# EAGLE schematic ILIZAROV_2 (EAGLE 7.2.0)
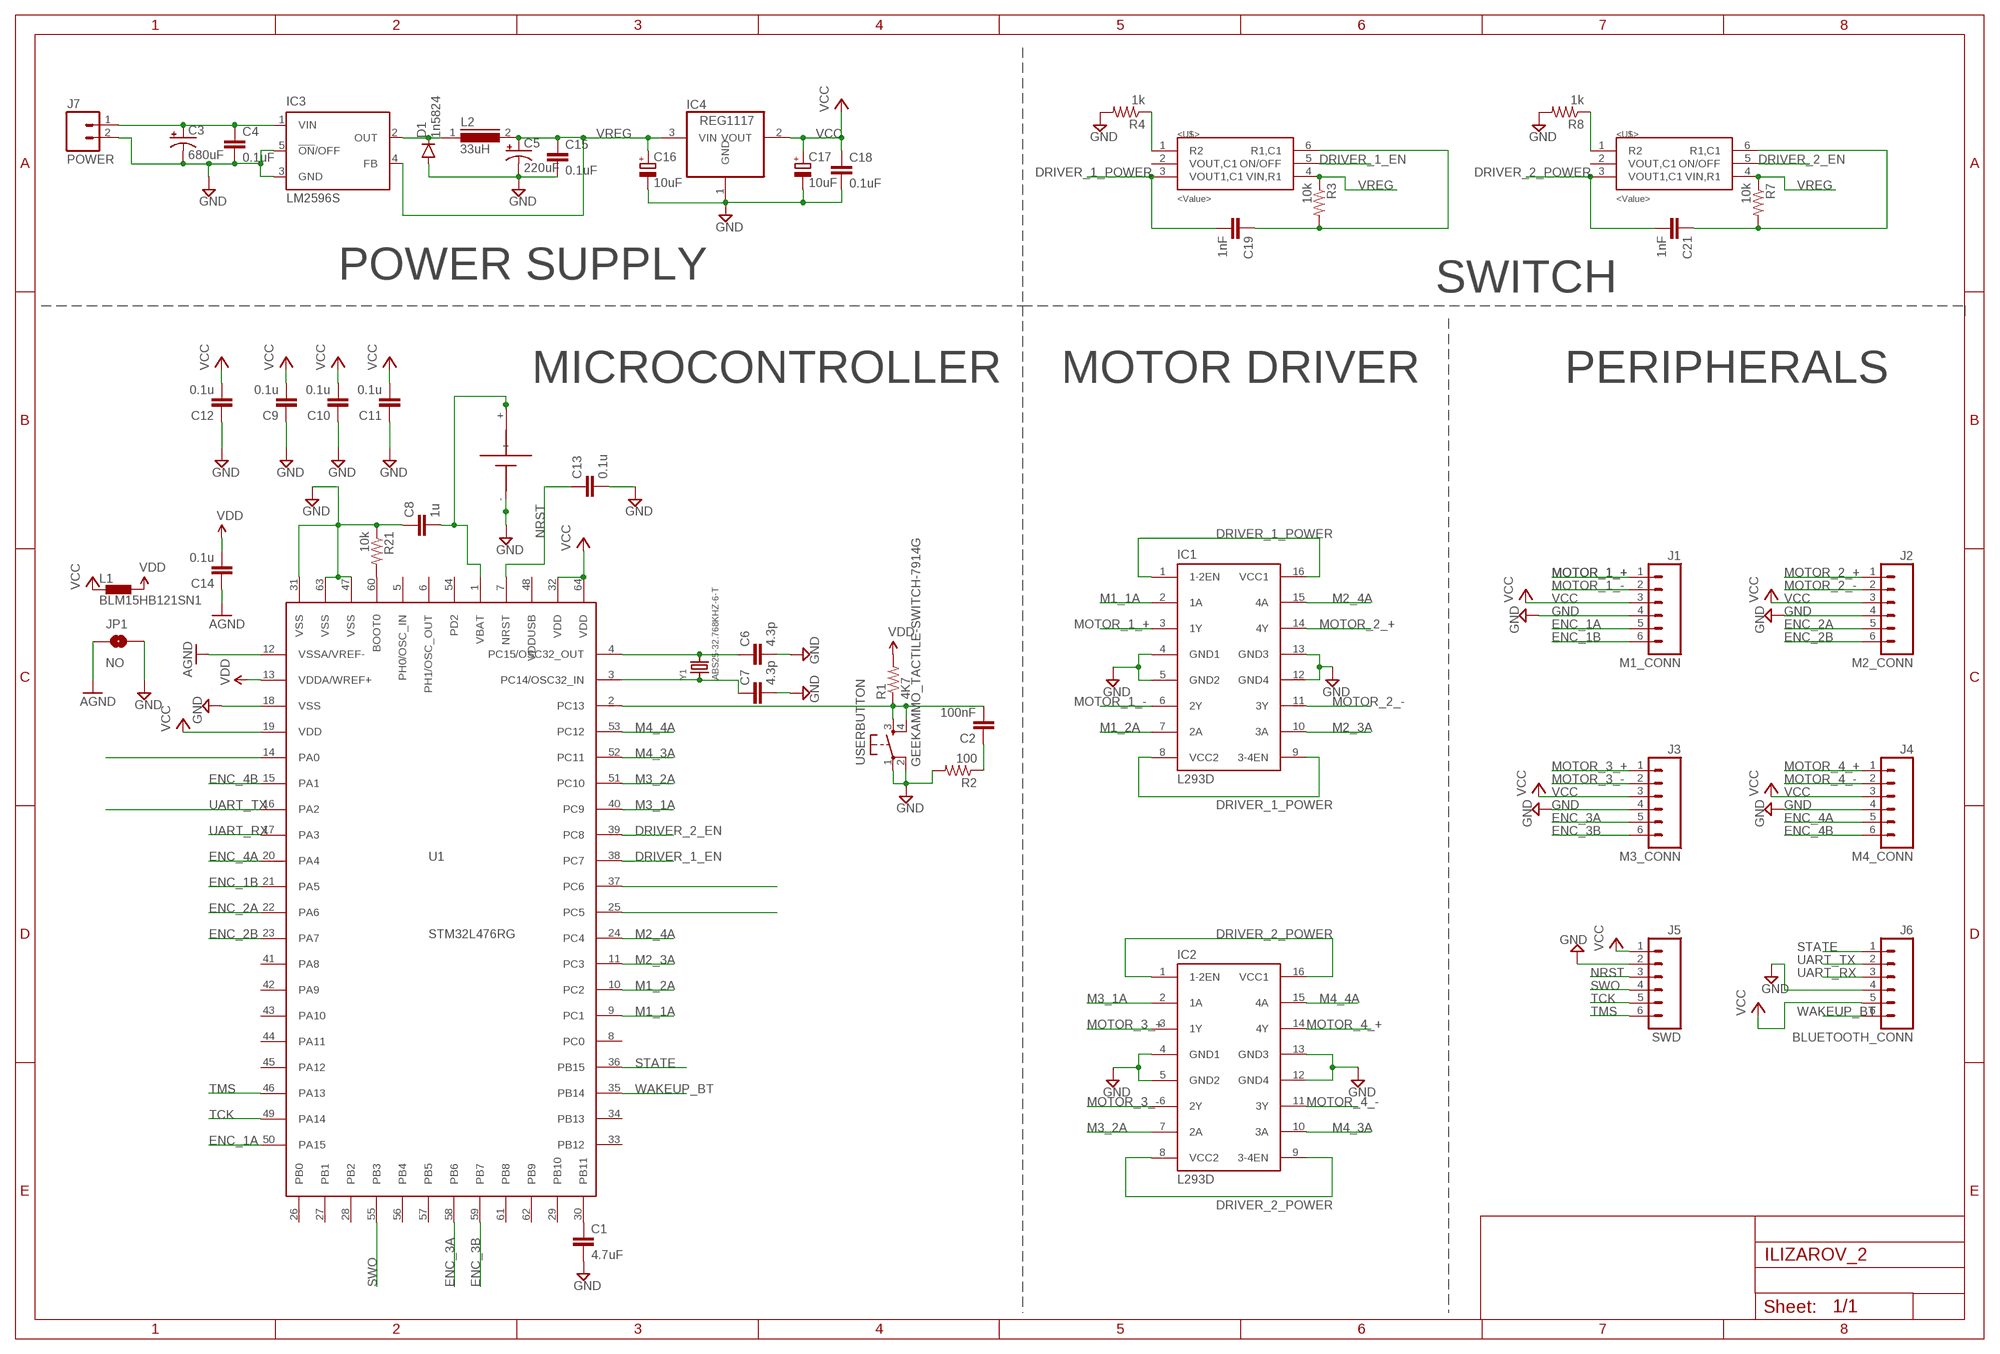
[diagram p0: schematic, sheet 1]

## Parts
BLUETOOTH_CONN  J6  M06  [06P]
C1  4.7uF  CAP1206  [1206]
C2  100nF  C-EUC0805  [C0805]
C3  680uF  CPOL-US140CLH-1010  [140CLH-1010]
C4  0.1uF  SPARKFUN-CAPACITORS_CAP1206  [SPARKFUN-CAPACITORS_1206]
C5  220uF  CPOL-US140CLH-1010  [140CLH-1010]
C6  4.3p  C-EUC0805  [C0805]
C7  4.3p  C-EUC0805  [C0805]
C8  1u  C-EUC0805  [C0805]
C9  0.1u  C-EUC0805  [C0805]
C10  0.1u  C-EUC0805  [C0805]
C11  0.1u  C-EUC0805  [C0805]
C12  0.1u  C-EUC0805  [C0805]
C13  0.1u  C-EUC0805  [C0805]
C14  0.1u  C-EUC0805  [C0805]
C15  0.1uF  SPARKFUN-CAPACITORS_CAP1206  [SPARKFUN-CAPACITORS_1206]
C16  10uF  CPOL-EUSMCC  [SMC_C]
C17  10uF  CPOL-EUSMCC  [SMC_C]
C18  0.1uF  SPARKFUN-CAPACITORS_CAP1206  [SPARKFUN-CAPACITORS_1206]
C19  1nF  C-EUC1206  [C1206]
C21  1nF  C-EUC1206  [C1206]
D1  1n5824  SPARKFUN-DISCRETESEMI_DIODESOD123  [SPARKFUN-DISCRETESEMI_SOD-123]
IC1  L293D  [DIL16]
IC2  L293D  [DIL16]
IC3  LM2596S  [TO263-5]
IC4  REG1117  [SOT223]
JP1  NO  JUMPER-PAD-2-NO  [PAD-JUMPER-2-NO_NO_SILK]
L1  BLM15HB121SN1  [0402]
L2  33uH  DR125  [DR125]
M1_CONN  J1  M06  [06P]
M2_CONN  J2  M06  [06P]
M3_CONN  J3  M06  [06P]
M4_CONN  J4  M06  [06P]
POWER  J7  M02  [02P]
R1  4K7  RESISTOR1206  [1206]
R2  100  RESISTOR1206  [1206]
R3  10k  RESISTOR1206  [1206]
R4  1k  RESISTOR1206  [1206]
R7  10k  RESISTOR1206  [1206]
R8  1k  RESISTOR1206  [1206]
R21  10k  R-US_M0805  [M0805]
SWD  J5  M06  [06P]
U1  STM32L476RG  [LQFP-10X10-64]
U$1  MS920  [SMD]
U$6  FDC6330L  [SOT23-6]
U$7  FDC6330L  [SOT23-6]
USERBUTTON  GEEKAMMO_TACTILE-SWITCH-7914G  [GEEKAMMO_7914G]
Y1  ABS25-32.768KHZ-6-T  CRYSTAL.ABS25  [ABS25]

## Nets
AGND: C14.1 JP1.1 U1.12(VSSA/VREF-)
DRIVER_1_EN: U1.38(PC7) U$7.5(ON/OFF)
DRIVER_1_POWER: C19.2 IC1.1(1-2EN) IC1.8(VCC2) IC1.9(3-4EN) IC1.16(VCC1) U$7.3(VOUT1,C1)
DRIVER_2_EN: U1.39(PC8) U$6.5(ON/OFF)
DRIVER_2_POWER: C21.2 IC2.1(1-2EN) IC2.8(VCC2) IC2.9(3-4EN) IC2.16(VCC1) U$6.3(VOUT1,C1)
ENC_1A: M1_CONN.5 U1.50(PA15)
ENC_1B: M1_CONN.6 U1.21(PA5)
ENC_2A: M2_CONN.5 U1.22(PA6)
ENC_2B: M2_CONN.6 U1.23(PA7)
ENC_3A: M3_CONN.5 U1.58(PB6)
ENC_3B: M3_CONN.6 U1.59(PB7)
ENC_4A: M4_CONN.5 U1.20(PA4)
ENC_4B: M4_CONN.6 U1.15(PA1)
GND: BLUETOOTH_CONN.4 C1.2 C3.- C4.2 C5.- C6.2 C7.2 C8.1 C9.1 C10.1 C11.1 C12.1 C13.2 C15.2 C16.- C17.- C18.2 D1.A IC1.4(GND1) IC1.5(GND2) IC1.12(GND4) IC1.13(GND3) IC2.4(GND1) IC2.5(GND2) IC2.12(GND4) IC2.13(GND3) IC3.3(GND) IC3.5(!ON!/OFF) IC4.1(GND) JP1.2 M1_CONN.4 M2_CONN.4 M3_CONN.4 M4_CONN.4 POWER.2 R2.2 R4.2 R8.2 R21.1 SWD.2 U1.18(VSS) U1.31(VSS) U1.47(VSS) U1.63(VSS) U$1.- USERBUTTON.1 USERBUTTON.2
M1_1A: IC1.2(1A) U1.9(PC1)
M1_2A: IC1.7(2A) U1.10(PC2)
M2_3A: IC1.10(3A) U1.11(PC3)
M2_4A: IC1.15(4A) U1.24(PC4)
M3_1A: IC2.2(1A) U1.40(PC9)
M3_2A: IC2.7(2A) U1.51(PC10)
M4_3A: IC2.10(3A) U1.52(PC11)
M4_4A: IC2.15(4A) U1.53(PC12)
MOTOR_1_+: IC1.3(1Y) M1_CONN.1
MOTOR_1_-: IC1.6(2Y) M1_CONN.2
MOTOR_2_+: IC1.14(4Y) M2_CONN.1
MOTOR_2_-: IC1.11(3Y) M2_CONN.2
MOTOR_3_+: IC2.3(1Y) M3_CONN.1
MOTOR_3_-: IC2.6(2Y) M3_CONN.2
MOTOR_4_+: IC2.14(4Y) M4_CONN.1
MOTOR_4_-: IC2.11(3Y) M4_CONN.2
N$1: C1.1 U1.30(PB11)
N$2: C2.2 R1.1 U1.2(PC13) USERBUTTON.3 USERBUTTON.4
N$3: C3.+ C4.1 IC3.1(VIN) POWER.1
N$4: C2.1 R2.1
N$5: R4.1 U$7.1(R2)
N$8: D1.C IC3.2(OUT) L2.1
N$13: C6.1 U1.4(PC15/OSC32_OUT) Y1.4
N$14: C7.1 U1.3(PC14/OSC32_IN) Y1.1
N$15: C19.1 R3.2 U$7.6(R1,C1)
N$18: C8.2 U1.1(VBAT) U$1.+
N$20: R21.2 U1.60(BOOT0)
N$21: R8.1 U$6.1(R2)
N$22: C21.1 R7.2 U$6.6(R1,C1)
NC: U1.14(PA0) U1.25(PC5) U1.37(PC6)
NRST: C13.1 SWD.3 U1.7(NRST)
STATE: BLUETOOTH_CONN.1 U1.36(PB15)
SWO: SWD.4 U1.55(PB3)
TCK: SWD.5 U1.49(PA14)
TMS: SWD.6 U1.46(PA13)
UART_RX: BLUETOOTH_CONN.3 U1.17(PA3)
UART_TX: BLUETOOTH_CONN.2 U1.16(PA2)
VCC: BLUETOOTH_CONN.5 C9.2 C10.2 C11.2 C12.2 C17.+ C18.1 IC4.2(VOUT) L1.1 M1_CONN.3 M2_CONN.3 M3_CONN.3 M4_CONN.3 SWD.1 U1.19(VDD) U1.32(VDD) U1.64(VDD)
VDD: C14.2 L1.2 R1.2 U1.13(VDDA/WREF+)
VREG: C5.+ C15.1 C16.+ IC3.4(FB) IC4.3(VIN) L2.2 R3.1 R7.1 U$6.4(VIN,R1) U$7.4(VIN,R1)
WAKEUP_BT: BLUETOOTH_CONN.6 U1.35(PB14)
Unconnected: U1.5(PH0/OSC_IN) U1.6(PH1/OSC_OUT) U1.8(PC0) U1.26(PB0) U1.27(PB1) U1.28(PB2) U1.29(PB10) U1.33(PB12) U1.34(PB13) U1.41(PA8) U1.42(PA9) U1.43(PA10) U1.44(PA11) U1.45(PA12) U1.54(PD2) U1.56(PB4) U1.57(PB5) U1.61(PB8) U1.62(PB9) U$6.2(VOUT,C1) U$7.2(VOUT,C1)

## Notes on the sheet
- POWER SUPPLY | SWITCH
- MICROCONTROLLER | MOTOR DRIVER | PERIPHERALS

## Power pins joined to a net without a drawn wire
VDDUSB: U1.48(VDDUSB)

## Library data of the parts
BLUETOOTH_CONN M1_CONN M2_CONN M3_CONN M4_CONN SWD = con-amp-quick:M06: AMP QUICK CONNECTOR; OC_FARNELL: unknown; OC_NEWARK: unknown
C1 = Moteino:CAP: Capacitor Standard 0603 ceramic capacitor, and 0.1" leaded capacitor.
C2 C6-C14 C19 C21 = resistor:C-EU: CAPACITOR, European symbol
C3 C5 = rcl:CPOL-US: POLARIZED CAPACITOR, American symbol
C4 C15 C18 = water level sensor_1_edited_i2c_RF_ver_1:SPARKFUN-CAPACITORS_CAP: Capacitor Standard 0603 ceramic capacitor, and 0.1" leaded capacitor.
C16 C17 = rcl:CPOL-EU: POLARIZED CAPACITOR, European symbol
D1 = water level sensor_1_edited_i2c_RF_ver_1:SPARKFUN-DISCRETESEMI_DIODE: Diode These are standard reverse protection diodes and small signal diodes. SMA package can handle up to about 1A. SOD-323 can handle about 200mA. What the SOD-323 package when ordering, there are some mfgs out there that are 5-pin packages.
IC1 IC2 = st-microelectronics:L293D: PUSH-PULL 4 CHANNEL DRIVER; MPN: L293D; OC_FARNELL: 9589619; OC_NEWARK: 56P8249
IC3 = national-semiconductor:LM2596: SIMPLE SWITCHER® Power Converter 150 kHz 3A Step-Down Voltage Regulator Source: http://www.national.com/ds/LM/LM2596.pdf; MF: NATIONAL SEMICONDUCTOR; MPN: LM2596S-ADJ/NOPB; OC_FARNELL: 9494367; OC_NEWARK: 41K3842
IC4 = burr-brown:REG1117: 800mA and 1A Low Dropout (LDO) Positive Regulator 1.8V, 2.5V, 2.85V, 3.3V, 5V, and Adj; MPN: REG1117; OC_FARNELL: 1097566; OC_NEWARK: 14P6981
JP1 = SparkFun-Passives:JUMPER-PAD-2-NO
L1 = inductors:BLM15H: EMIFIL (R) Chip Ferrite Bead for GHz Noise Source: http://www.murata.com/ Ferrite Bead BLM15H.pdf
L2 = inductors:DR125: High Power Density, High Efficiency, Shielded Inductors Source: coiltronics_dr_series.pdf
POWER = con-amp-quick:M02: AMP QUICK CONNECTOR; OC_FARNELL: unknown; OC_NEWARK: unknown
R1-R4 R7 R8 = Moteino:RESISTOR: Resistor Basic schematic elements and footprints for 0603, 1206, and PTH resistors.
R21 = resistor:R-US_: RESISTOR, American symbol
U1 = stm32l4xx:STM32L476RG
U$1 = batt_ms920:MS920
U$6 U$7 = FDC6330L:FDC6330L
USERBUTTON = water level sensor_1_edited_i2c_RF_ver_1:GEEKAMMO_TACTILE-SWITCH: Tactile Switch 4 Pins, SPST NO
Y1 = abracon:CRYSTAL